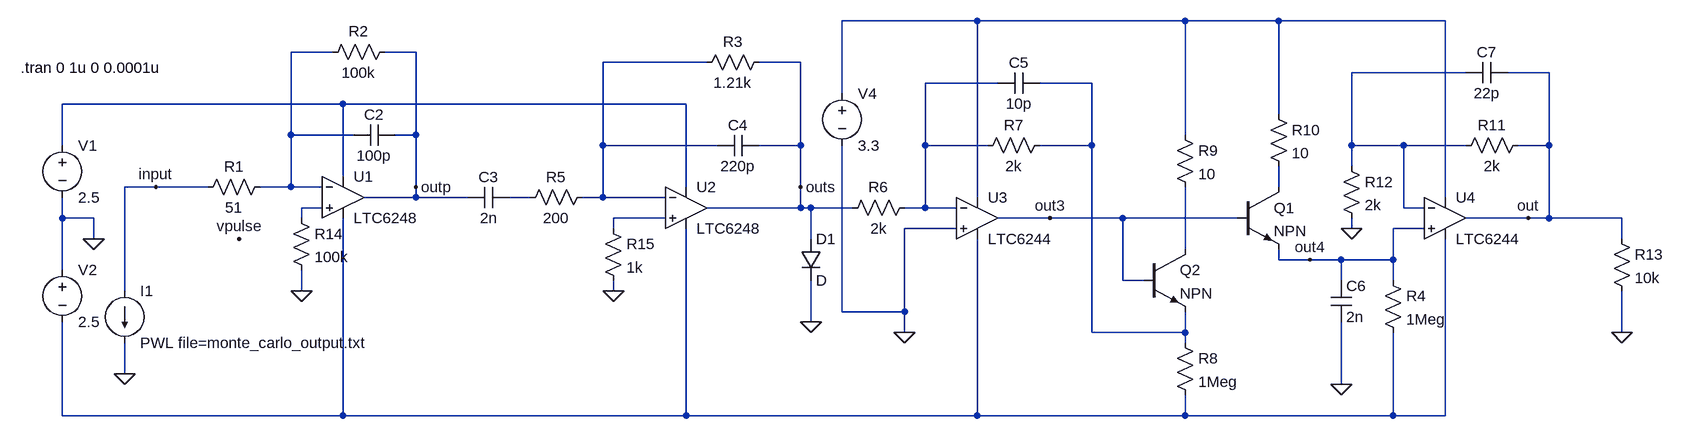
[diagram p0: schematic PHA_current.asc]
PHA_current.asc, the LTspice schematic file:
Version 4
SHEET 1 2500 680
WIRE 1264 -208 1056 -208
WIRE 1584 -208 1264 -208
WIRE 1728 -208 1584 -208
WIRE 1984 -208 1728 -208
WIRE 272 -160 208 -160
WIRE 400 -160 352 -160
WIRE 848 -144 688 -144
WIRE 992 -144 928 -144
WIRE 2016 -128 1840 -128
WIRE 2144 -128 2080 -128
WIRE 1296 -112 1184 -112
WIRE 1440 -112 1360 -112
WIRE 1056 -96 1056 -208
WIRE 288 -80 -144 -80
WIRE 816 -80 288 -80
WIRE 1728 -64 1728 -208
WIRE 208 -32 208 -160
WIRE 304 -32 208 -32
WIRE 400 -32 400 -160
WIRE 400 -32 368 -32
WIRE 1584 -32 1584 -208
WIRE -144 -16 -144 -80
WIRE 688 -16 688 -144
WIRE 864 -16 688 -16
WIRE 992 -16 992 -144
WIRE 992 -16 928 -16
WIRE 1184 -16 1184 -112
WIRE 1280 -16 1184 -16
WIRE 1440 -16 1440 -112
WIRE 1440 -16 1360 -16
WIRE 1840 -16 1840 -128
WIRE 1920 -16 1840 -16
WIRE 2016 -16 1920 -16
WIRE 2144 -16 2144 -128
WIRE 2144 -16 2096 -16
WIRE 1840 16 1840 -16
WIRE 288 32 288 -80
WIRE 0 48 -48 48
WIRE 80 48 0 48
WIRE 208 48 208 -32
WIRE 208 48 160 48
WIRE 256 48 208 48
WIRE 400 48 400 -32
WIRE 816 48 816 -80
WIRE 992 48 992 -16
WIRE 1728 48 1728 16
WIRE 400 64 400 48
WIRE 400 64 320 64
WIRE 480 64 400 64
WIRE 576 64 544 64
WIRE 688 64 688 -16
WIRE 688 64 656 64
WIRE 784 64 688 64
WIRE 1264 64 1264 -208
WIRE 1984 64 1984 -208
WIRE 256 80 224 80
WIRE 992 80 992 48
WIRE 992 80 848 80
WIRE 1008 80 992 80
WIRE 1072 80 1008 80
WIRE 1184 80 1184 -16
WIRE 1184 80 1152 80
WIRE 1232 80 1184 80
WIRE 1920 80 1920 -16
WIRE 1952 80 1920 80
WIRE -144 96 -144 64
WIRE -96 96 -144 96
WIRE 224 96 224 80
WIRE 784 96 704 96
WIRE 1376 96 1296 96
WIRE 1488 96 1376 96
WIRE 1664 96 1488 96
WIRE 2112 96 2016 96
WIRE 2144 96 2144 -16
WIRE 2144 96 2112 96
WIRE 2256 96 2144 96
WIRE 704 112 704 96
WIRE 1232 112 1152 112
WIRE 1840 112 1840 96
WIRE 1952 112 1904 112
WIRE -96 128 -96 96
WIRE 1008 128 1008 80
WIRE 2256 128 2256 96
WIRE 1584 144 1584 48
WIRE 1728 160 1728 144
WIRE 1776 160 1728 160
WIRE 1824 160 1776 160
WIRE 1904 160 1904 112
WIRE 1904 160 1824 160
WIRE -144 176 -144 96
WIRE 1488 192 1488 96
WIRE 1520 192 1488 192
WIRE 1824 192 1824 160
WIRE 1904 192 1904 160
WIRE -48 208 -48 48
WIRE 224 208 224 176
WIRE 704 208 704 192
WIRE 1056 240 1056 -16
WIRE 1152 240 1152 112
WIRE 1152 240 1056 240
WIRE 1008 256 1008 192
WIRE 1152 272 1152 240
WIRE 1440 272 1440 -16
WIRE 1584 272 1584 240
WIRE 1584 272 1440 272
WIRE 2256 272 2256 208
WIRE 1584 288 1584 272
WIRE -48 336 -48 288
WIRE 1824 352 1824 256
WIRE -144 400 -144 256
WIRE 288 400 288 96
WIRE 288 400 -144 400
WIRE 816 400 816 112
WIRE 816 400 288 400
WIRE 1264 400 1264 128
WIRE 1264 400 816 400
WIRE 1584 400 1584 368
WIRE 1584 400 1264 400
WIRE 1904 400 1904 272
WIRE 1904 400 1584 400
WIRE 1984 400 1984 128
WIRE 1984 400 1904 400
FLAG 224 208 0
FLAG -96 128 0
FLAG 400 48 outp
FLAG 704 208 0
FLAG 992 48 outs
FLAG 1152 272 0
FLAG 1376 96 out3
FLAG 1840 112 0
FLAG 2112 96 out
FLAG 2256 272 0
FLAG 1776 160 out4
FLAG 1824 352 0
FLAG 1008 256 0
FLAG -48 336 0
FLAG 128 128 vpulse
FLAG 0 48 input
SYMBOL res 176 32 R90
WINDOW 0 0 56 VBottom 2
WINDOW 3 32 56 VTop 2
SYMATTR InstName R1
SYMATTR Value 51
SYMBOL cap 368 -48 R90
WINDOW 0 0 32 VBottom 2
WINDOW 3 32 32 VTop 2
SYMATTR InstName C2
SYMATTR Value 100p
SYMBOL voltage -144 -32 R0
SYMATTR InstName V1
SYMATTR Value 2.5
SYMBOL voltage -144 160 R0
SYMATTR InstName V2
SYMATTR Value 2.5
SYMBOL res 368 -176 R90
WINDOW 0 0 56 VBottom 2
WINDOW 3 32 56 VTop 2
SYMATTR InstName R2
SYMATTR Value 100k
SYMBOL cap 544 48 R90
WINDOW 0 0 32 VBottom 2
WINDOW 3 32 32 VTop 2
SYMATTR InstName C3
SYMATTR Value 2n
SYMBOL cap 928 -32 R90
WINDOW 0 0 32 VBottom 2
WINDOW 3 32 32 VTop 2
SYMATTR InstName C4
SYMATTR Value 220p
SYMBOL res 944 -160 R90
WINDOW 0 0 56 VBottom 2
WINDOW 3 32 56 VTop 2
SYMATTR InstName R3
SYMATTR Value 1.21k
SYMBOL res 672 48 R90
WINDOW 0 0 56 VBottom 2
WINDOW 3 32 56 VTop 2
SYMATTR InstName R5
SYMATTR Value 200
SYMBOL LTC6244 1264 96 R0
SYMATTR InstName U3
SYMBOL res 1168 64 R90
WINDOW 0 0 56 VBottom 2
WINDOW 3 32 56 VTop 2
SYMATTR InstName R6
SYMATTR Value 2k
SYMBOL res 1376 -32 R90
WINDOW 0 0 56 VBottom 2
WINDOW 3 32 56 VTop 2
SYMATTR InstName R7
SYMATTR Value 2k
SYMBOL cap 1360 -128 R90
WINDOW 0 0 32 VBottom 2
WINDOW 3 32 32 VTop 2
SYMATTR InstName C5
SYMATTR Value 10p
SYMBOL LTC6244 1984 96 R0
SYMATTR InstName U4
SYMBOL res 1888 176 R0
SYMATTR InstName R4
SYMATTR Value 1Meg
SYMBOL cap 1808 192 R0
SYMATTR InstName C6
SYMATTR Value 2n
SYMBOL npn3 1664 48 R0
SYMATTR InstName Q1
SYMBOL npn3 1520 144 R0
SYMATTR InstName Q2
SYMBOL res 1568 272 R0
SYMATTR InstName R8
SYMATTR Value 1Meg
SYMBOL res 1568 -48 R0
SYMATTR InstName R9
SYMATTR Value 10
SYMBOL res 1712 -80 R0
SYMATTR InstName R10
SYMATTR Value 10
SYMBOL res 2112 -32 R90
WINDOW 0 0 56 VBottom 2
WINDOW 3 32 56 VTop 2
SYMATTR InstName R11
SYMATTR Value 2k
SYMBOL res 1824 0 R0
SYMATTR InstName R12
SYMATTR Value 2k
SYMBOL res 2240 112 R0
SYMATTR InstName R13
SYMATTR Value 10k
SYMBOL cap 2080 -144 R90
WINDOW 0 0 32 VBottom 2
WINDOW 3 32 32 VTop 2
SYMATTR InstName C7
SYMATTR Value 22p
SYMBOL LTC6248 288 64 R0
SYMATTR InstName U1
SYMBOL LTC6248 816 80 R0
SYMATTR InstName U2
SYMBOL voltage 1056 -112 R0
WINDOW 123 0 0 Left 2
WINDOW 39 0 0 Left 2
SYMATTR InstName V4
SYMATTR Value 3.3
SYMBOL res 208 80 R0
SYMATTR InstName R14
SYMATTR Value 100k
SYMBOL res 688 96 R0
SYMATTR InstName R15
SYMATTR Value 1k
SYMBOL diode 992 128 R0
SYMATTR InstName D1
SYMBOL current -48 208 R0
WINDOW 123 0 0 Left 0
WINDOW 39 0 0 Left 0
SYMATTR InstName I1
SYMATTR Value PWL file=monte_carlo_output.txt
TEXT -208 -136 Left 2 !.tran 0 1u 0 0.0001u

The netlist it stands for:
* PHA_current.asc
R1 N002 input 51
C2 outp N002 100p
V1 N007 0 2.5
V2 0 N013 2.5
R2 outp N002 100k
C3 N009 outp 2n
C4 outs N003 220p
R3 outs N003 1.21k
R5 N003 N009 200
XU3 0 N005 N001 N013 out3 LTC6244  ; pins In+ In- V+ V- OUT
R6 N005 outs 2k
R7 N006 N005 2k
C5 N006 N005 10p
XU4 out4 N004 N001 N013 out LTC6244  ; pins In+ In- V+ V- OUT
R4 out4 N013 1Meg
C6 out4 0 2n
Q1 N008 out3 out4 0 NPN
Q2 N012 out3 N006 0 NPN
R8 N006 N013 1Meg
R9 N001 N012 10
R10 N001 N008 10
R11 out N004 2k
R12 N004 0 2k
R13 out 0 10k
C7 out N004 22p
* U1: LTC6248 (symbol LTC6248 not available, pins judged from their places): In+=N010 In-=N002 V+=N007 V-=N013 OUT=outp
* U2: LTC6248 (symbol LTC6248 not available, pins judged from their places): In+=N011 In-=N003 V+=N007 V-=N013 OUT=outs
V4 N001 0 3.3
R14 N010 0 100k
R15 N011 0 1k
D1 outs 0 D
I1 input 0 PWL file=monte_carlo_output.txt
.model D D
.lib standard.dio
.model NPN NPN
.model PNP PNP
.lib standard.bjt
.tran 0 1u 0 0.0001u
.backanno
.end